# EAGLE design TurnoutController (EAGLE 7.6.0)
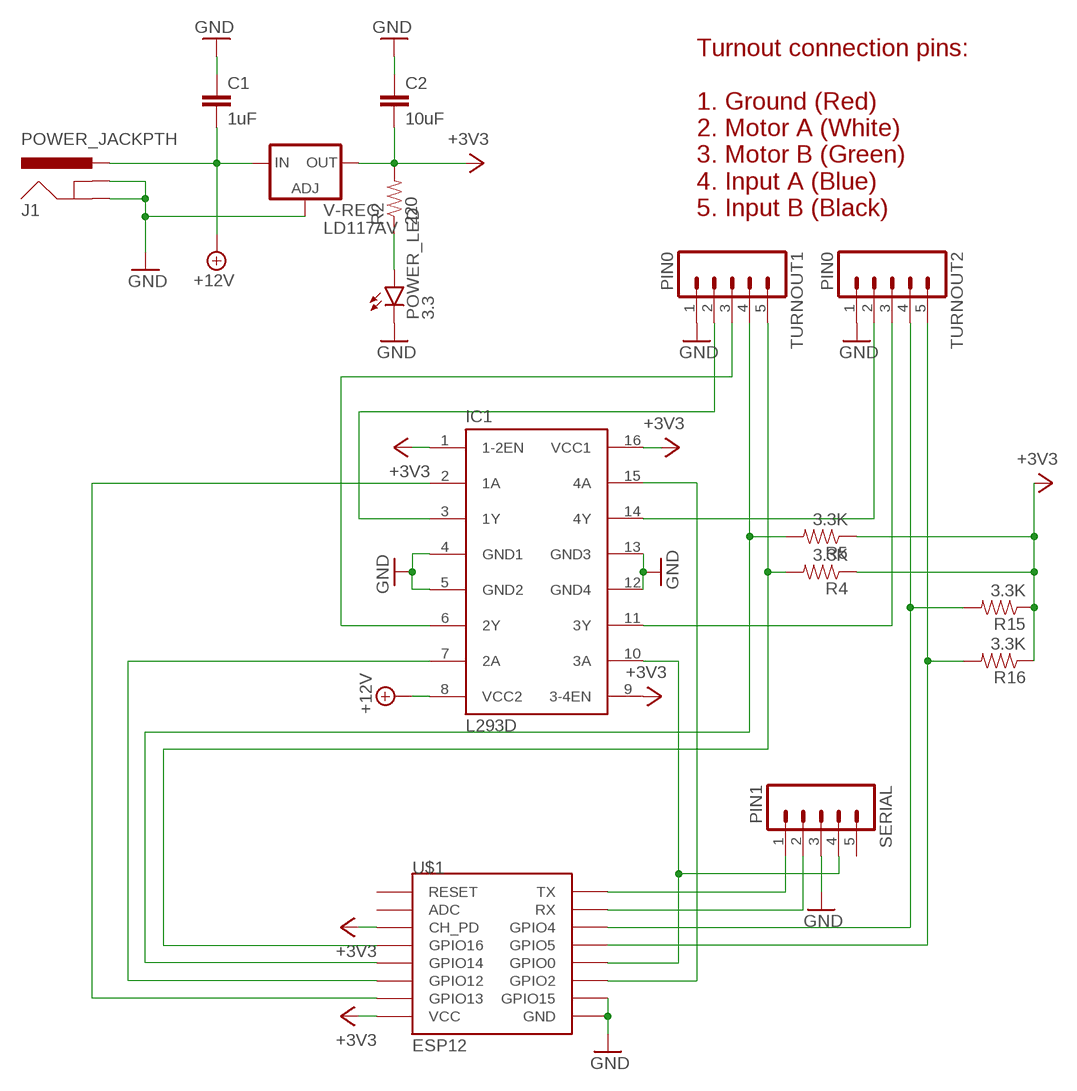
[diagram p0: schematic, sheet 1]

## Parts
C1  1uF  CAPPTH  [CAP-PTH-SMALL]
C2  10uF  CAPPTH  [CAP-PTH-SMALL]
IC1  L293D  [DIL16]
J1  POWER_JACKPTH  [POWER_JACK_PTH]
POWER_LED  3.3  LED5MM  [LED5MM]
R2  220  RESISTORPTH-1/4W  [AXIAL-0.4]
R4  3.3K  RESISTORPTH-1/4W  [AXIAL-0.4]
R5  3.3K  RESISTORPTH-1/4W  [AXIAL-0.4]
R15  3.3K  RESISTORPTH-1/4W  [AXIAL-0.4]
R16  3.3K  RESISTORPTH-1/4W  [AXIAL-0.4]
SERIAL  PIN1  M05  [05P]
TURNOUT1  PIN0  M05  [05P]
TURNOUT2  PIN0  M05  [05P]
U$1  ESP12  [ESP12]
V-REG  LD117AV  [TO220L1]

## Nets
+3V3: C2.2 IC1.1(1-2EN) IC1.9(3-4EN) IC1.16(VCC1) R2.P$2 R4.P$1 R5.P$1 R15.P$1 R16.P$1 U$1.CH_PD U$1.VCC V-REG.2(OUT)
+12V: C1.2 IC1.8(VCC2) J1.PWR V-REG.3(IN)
GND: C1.1 C2.1 IC1.4(GND1) IC1.5(GND2) IC1.12(GND4) IC1.13(GND3) J1.GND J1.GNDBREAK POWER_LED.K(C) SERIAL.3 TURNOUT1.1 TURNOUT2.1 U$1.GND U$1.GPIO15 V-REG.1(ADJ)
N$2: R16.P$2 TURNOUT2.5 U$1.GPIO5
N$3: IC1.3(1Y) TURNOUT1.2
N$4: SERIAL.1 U$1.TX
N$5: R15.P$2 TURNOUT2.4 U$1.GPIO4
N$6: IC1.6(2Y) TURNOUT1.3
N$7: POWER_LED.A R2.P$1
N$8: IC1.7(2A) U$1.GPIO12
N$9: IC1.2(1A) U$1.GPIO13
N$10: IC1.14(4Y) TURNOUT2.2
N$11: SERIAL.2 U$1.RX
N$12: R5.P$2 TURNOUT1.4 U$1.GPIO14
N$13: IC1.11(3Y) TURNOUT2.3
N$15: IC1.10(3A) SERIAL.4 U$1.GPIO0
N$17: IC1.15(4A) U$1.GPIO2
N$29: R4.P$2 TURNOUT1.5 U$1.GPIO16
Unconnected: SERIAL.5 U$1.ADC U$1.RESET

## Notes on the sheet
- Turnout connection pins:
  
  1. Ground (Red)
  2. Motor A (White)
  3. Motor B (Green)
  4. Input A (Blue)
  5. Input B (Black)

## Library data of the parts
C1 C2 = SparkFun-Capacitors:CAP: Capacitor Standard 0603 ceramic capacitor, and 0.1" leaded capacitor.
IC1 = st-microelectronics:L293D: PUSH-PULL 4 CHANNEL DRIVER; MPN: L293D; OC_FARNELL: 9589619; OC_NEWARK: 56P8249
J1 = SparkFun-Connectors:POWER_JACK: Power Jack This is the standard 5.5mm barrel jack for power. The PTH is the most common, proven, reliable, footprint. The Slot footprint only works if the mill layer is transmitted to the PCB fab house so be warned. Mating wall wart : TOL-00298 (and others); PROD_ID: CONN-08197
POWER_LED = SparkFun-LED:LED: LEDs Standard schematic elements and footprints for 5mm, 3mm, 1206, and 0603 sized LEDs. 5mm - Spark Fun Electronics SKU : COM-00529 (and others)
R2 R4 R5 R15 R16 = SparkFun-Resistors:RESISTOR: Resistor Basic schematic elements and footprints for 0603, 1206, and PTH resistors.
SERIAL TURNOUT1 TURNOUT2 = con-amp-quick:M05: AMP QUICK CONNECTOR; OC_FARNELL: unknown; OC_NEWARK: unknown
U$1 = esp8266modules:ESP12: ESP8266 Wifi module 12
V-REG = v-reg:LD117A?*: Low drop fixed and adjustable positive voltage regulators 1 A Source: http://www.st.com/stonline/products/literature/ds/7194/ld1117axx.pdf

## Board
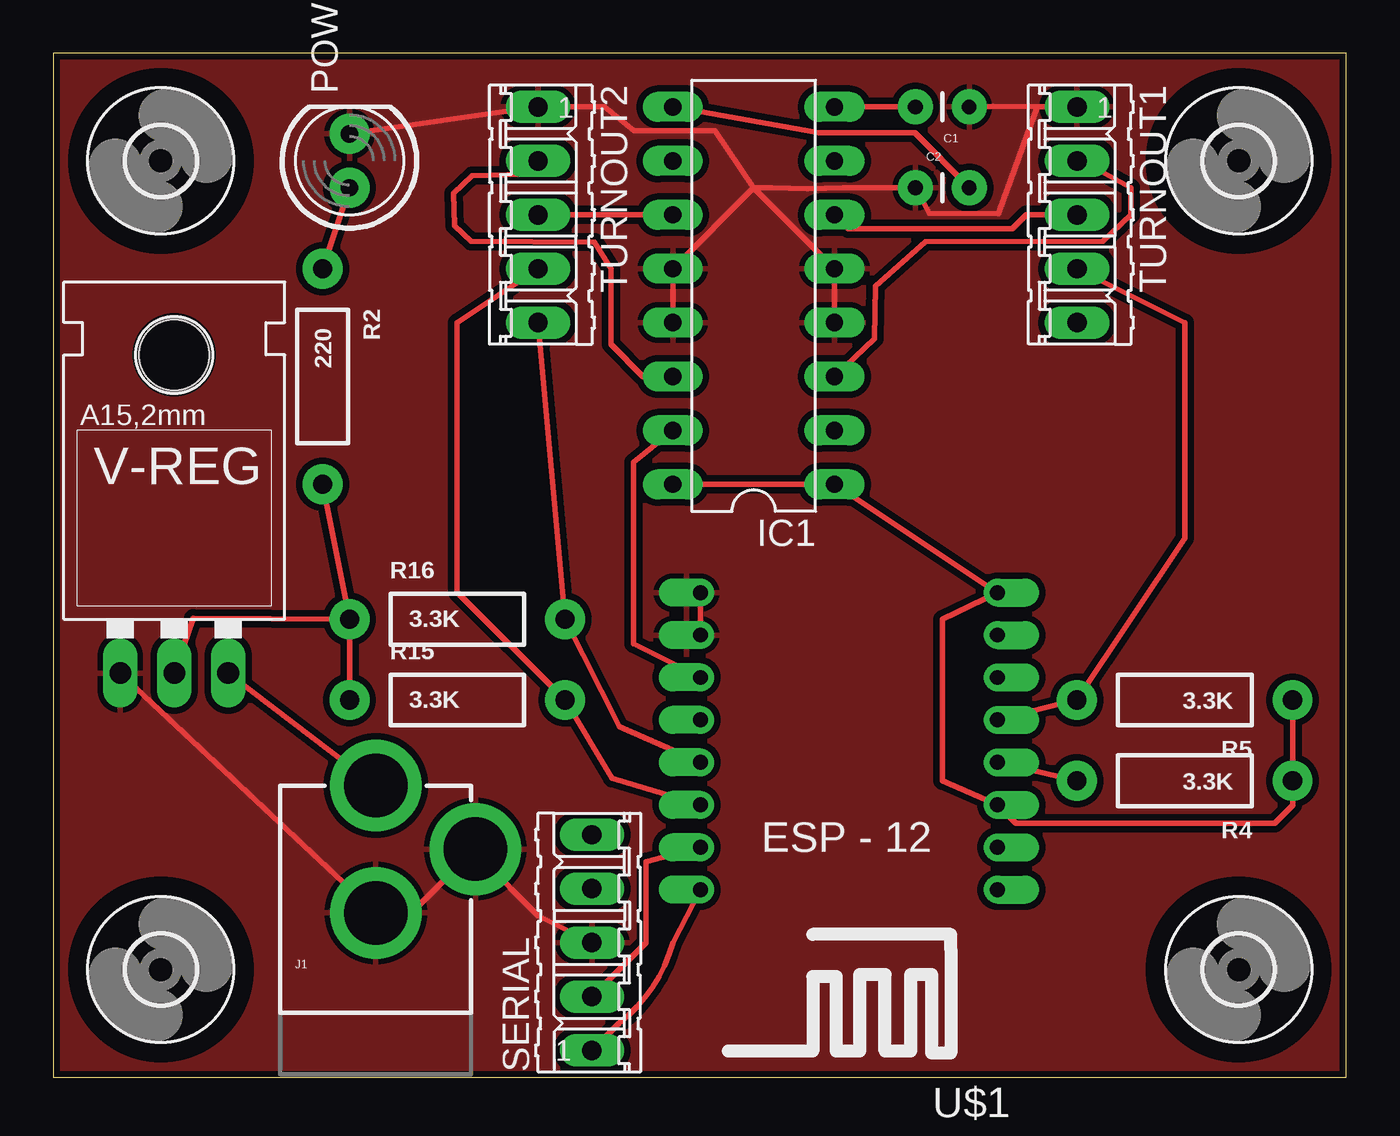
[diagram p1: board, top side]
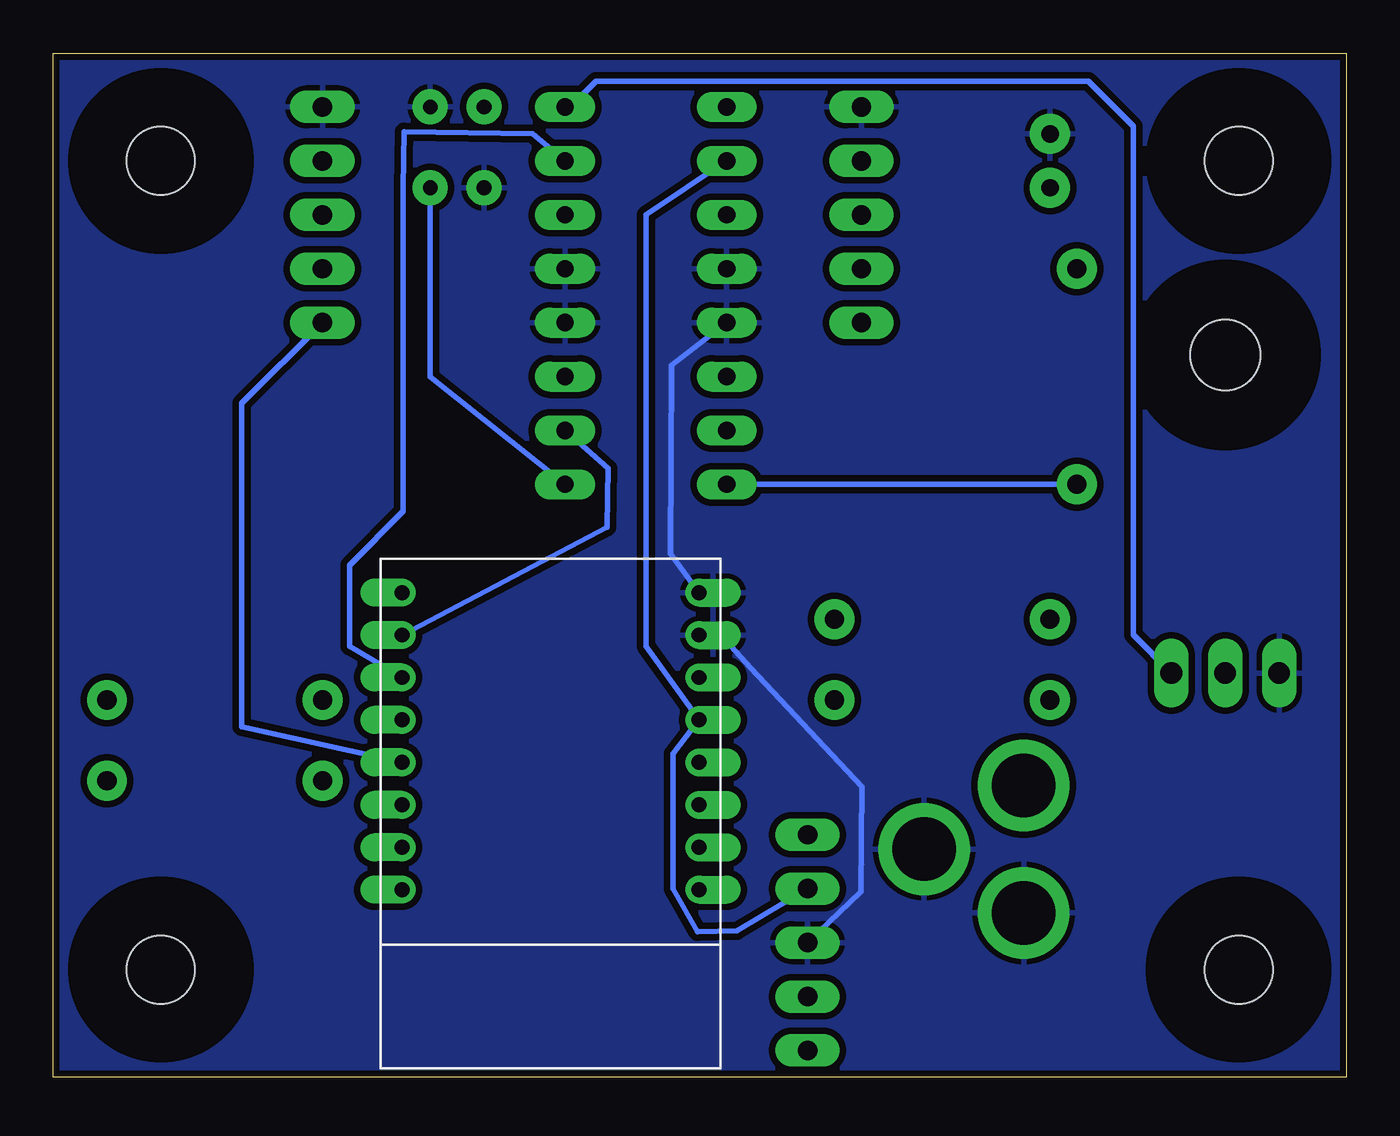
[diagram p2: board, bottom side, seen from below]

Size 60.96 x 48.26 mm. Coordinates in mm from the lower left corner, seen from the top.
Outline: 0,0 60.96,0 60.96,48.26 0,48.26 0,0
Copper layers (1*16): Top 0.035mm / dielectric 1.5mm / Bottom 0.035mm
Design rules "SparkFun": minimum track width 8mil, minimum drill 20mil, track to track 8mil, track to pad 8mil, pad to pad 8mil, via to via 8mil, smd to smd 8mil, copper to edge 8mil, drill to drill 8mil, minimum pad ring 12mil, minimum via ring 10mil, stop-mask expansion 4mil, vias tented up to drill 20mil, thermal gap 10mil

### Footprints (pad centres in the part's own frame; a part is rotated, then mirrored left to right if it is on the bottom)
CAP-PTH-SMALL = drill 0.7 pad 1.651: 1 0,0; 2 2.54,0
DIL16 = drill 0.813 long: 1 -8.89,-3.81; 2 -6.35,-3.81; 3 -3.81,-3.81; 4 -1.27,-3.81; 5 1.27,-3.81; 6 3.81,-3.81; 7 6.35,-3.81; 8 8.89,-3.81; 9 8.89,3.81; 10 6.35,3.81; 11 3.81,3.81; 12 1.27,3.81; 13 -1.27,3.81; 14 -3.81,3.81; 15 -6.35,3.81; 16 -8.89,3.81
POWER_JACK_PTH = drill 2.997 pad 4.318: GND 0,7.7; GNDBREAK 4.7,10.7; PWR 0,13.7
LED5MM = drill 0.813 pad 1.88: A -1.27,0; K 1.27,0
AXIAL-0.4 = drill 0.9 pad 1.88: P$1 -5.08,0; P$2 5.08,0
05P = drill 0.914 long: 1 -5.08,0; 2 -2.54,0; 3 0,0; 4 2.54,0; 5 5.08,0
ESP12 = drill 0.7 offset: ADC -7.1,3.8; CH_PD -7.1,1.8; GND 6.9,-8.2; GPIO0 6.9,-2.2; GPIO2 6.9,-4.2; GPIO4 6.9,1.8; GPIO5 6.9,-0.2; GPIO12 -7.1,-4.2; GPIO13 -7.1,-6.2; GPIO14 -7.1,-2.2; GPIO15 6.9,-6.2; GPIO16 -7.1,-0.2; RESET -7.1,5.8; RX 6.9,3.8; TX 6.9,5.8; VCC -7.1,-8.2
3,2 = hole 3.2: 0,0
TO220L1 = drill 1.016 long: 1 -2.54,-3.81; 2 0,-3.81; 3 2.54,-3.81 | hole 3.302: 0,11.176

### Placement (x,y rotation side)
C1  43.18,45.72 180 top
C2  40.64,41.91 0 top
IC1  33.02,36.83 90 top
J1  15.21,0.05 0 top
POWER_LED  13.97,43.18 90 top
R2  12.7,33.02 270 top
R4  53.34,13.97 180 top
R5  53.34,17.78 180 top
R15  19.05,17.78 0 top
R16  19.05,21.59 0 top
SERIAL  25.4,6.35 90 top
TURNOUT1  48.26,40.64 270 top
TURNOUT2  22.86,40.64 270 top
U$1  37.41,14.64 180 top
U$2  [3,2]  5.08,43.18 0 top
U$3  [3,2]  55.88,43.18 0 top
U$4  [3,2]  5.08,5.08 0 top
U$5  [3,2]  55.88,5.08 0 top
V-REG  5.71,22.86 0 top

### Tracks (layer width: path | path; a pad name or v marks a point on that pad's centre or on a via)
+3V3
  Top 0.254: IC1.9 36.09,44.5 40.62,44.5 C2.2 | V-REG.2 6.6,21.63 R16.P$1 | R16.P$1 R2.P$2 | R15.P$1 R16.P$1 | IC1.16 IC1.1 U$1.VCC 41.91,21.59 41.91,13.97 U$1.CH_PD 45.38,11.98 57.59,11.98 58.42,12.81 R4.P$1 R5.P$1
  Bottom 0.254: R2.P$2 IC1.16 | IC1.1 43.18,33.02 C2.2
+12V
  Top 0.254: J1.PWR V-REG.3 | C1.2 IC1.8
  Bottom 0.254: IC1.8 36.63,45.72 36.6,45.69 35.36,46.93 12.17,46.93 10.05,44.82 10.05,20.85 V-REG.3
GND
  Top 0.254: U$1.GPIO15 U$1.GND | C1.1 44.3,45.74 46.38,45.74 | 46.38,45.74 TURNOUT1.1 | SERIAL.3 22.86,7.62 21.59,8.89 J1.GNDBREAK 16.91,7.75 J1.GND V-REG.1 | POWER_LED.K TURNOUT2.1 25.98,45.72 27.38,44.61 31.19,44.61 33.02,41.91 | 33.02,41.91 IC1.12 IC1.13 | 33.02,41.91 IC1.5 IC1.4 | 33.02,41.91 arc-3 35.56,41.87 arc-3 38.1,41.91 C2.1 41.3,40.71 44.56,40.69 46.38,45.74
  Bottom 0.254: IC1.13 31.81,33.56 31.86,24.68 U$1.GND | SERIAL.3 22.89,8.75 22.84,13.68 28.1,19.31 29.49,20.84 U$1.GPIO15
  pour Top (isolate 0.305): 0,0 0,48.26 60.96,48.26 60.96,0
  pour Bottom (isolate 0.305): 0,0 0,48.26 60.96,48.26 60.96,0
N$2
  Top 0.254: U$1.GPIO5 26.7,16.52 R16.P$2 TURNOUT2.5
N$3
  Top 0.254: IC1.3 38.72,34.8 38.77,37.28 41.13,39.37 49.47,39.39 50.8,40.64 50.8,41.91 48.62,43.11 TURNOUT1.2
N$4
  Top 0.254: SERIAL.1 26.67,2.54 arc37 29.21,6.35 U$1.TX
N$5
  Top 0.254: U$1.GPIO4 26.34,14.1 R15.P$2 19.05,22.86 19.05,35.56 TURNOUT2.4
N$6
  Top 0.254: TURNOUT1.3 45.87,40.64 45.22,39.99 37.48,39.99 IC1.6
N$7
  Top 0.254: R2.P$1 POWER_LED.A
N$8
  Bottom 0.254: IC1.7 38.36,44.45 44.42,44.56 44.45,41.91 44.45,26.67 46.99,24.13 46.99,20.32 U$1.GPIO12
N$9
  Bottom 0.254: U$1.GPIO13 34.85,25.92 34.8,28.71 IC1.2
N$10
  Top 0.254: TURNOUT2.2 22.22,42.54 19.75,42.49 18.87,41.66 18.92,40.12 19.7,39.39 25.52,39.34 26.29,38.1 26.29,34.54 27.81,33.02 IC1.14
N$11
  Top 0.254: SERIAL.2 27.94,6.35 27.94,10.16 U$1.RX
N$12
  Top 0.254: U$1.GPIO14 R5.P$2 53.34,25.4 53.34,35.56 TURNOUT1.4
N$13
  Top 0.254: IC1.11 TURNOUT2.3
N$15
  Bottom 0.254: IC1.10 33.02,40.64 33.02,20.32 U$1.GPIO0 31.75,15.24 31.75,8.89 30.59,6.87 28.71,6.92 SERIAL.4
N$17
  Top 0.254: U$1.GPIO2 27.37,20.43 27.37,28.99 IC1.15
N$29
  Top 0.254: U$1.GPIO16 R4.P$2
  Bottom 0.254: U$1.GPIO16 52.07,16.51 52.07,31.75 TURNOUT1.5